# Altium schematic sheet Output.SchDoc: Output
size A3; Organization: Hofmann Travel; SheetNumber: 5; SheetTotal: 10
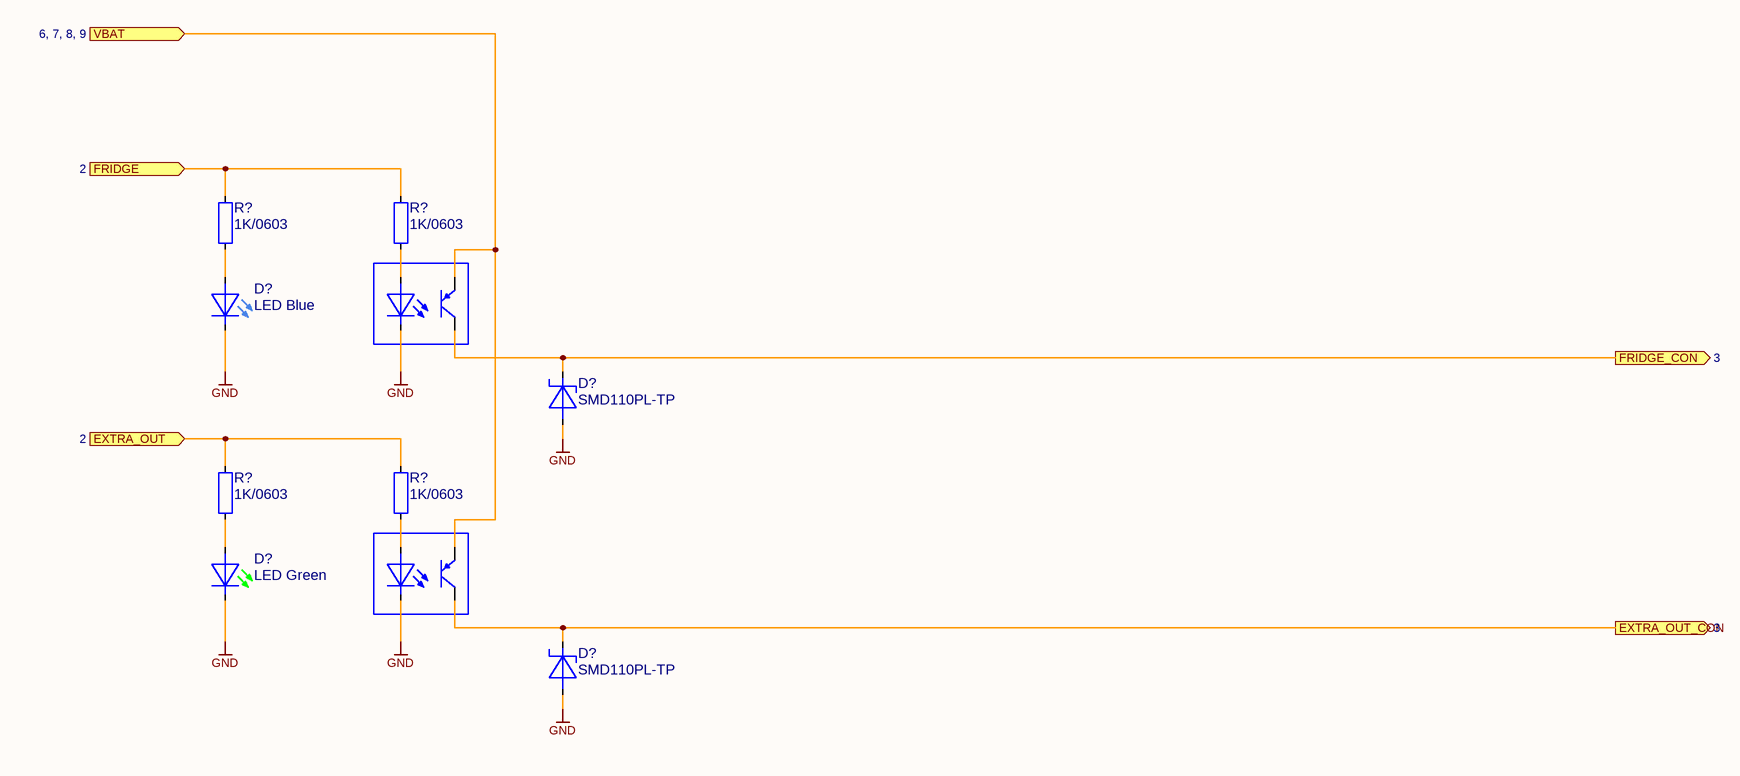
[diagram p0: Output.SchDoc]

## Parts
(Parts that share a designator on the sheet are numbered #1, #2 ... from top to bottom, then left to right.)
D?#1  LED Blue  [LED0603_BLUE]
D?#2  LED White  [LED0603_WHITE]  (value not drawn)
D?#3  SMD110PL-TP  [SOD3718X125]
D?#4  LED Green  [LED0603_GREEN]
D?#5  LED White  [LED0603_WHITE]  (value not drawn)
D?#6  SMD110PL-TP  [SOD3718X125]
Q?#1  MMBT4403L  [SOT2395P280X125-3-SE]  (value not drawn)
Q?#2  MMBT4403L  [SOT2395P280X125-3-SE]  (value not drawn)
R?#1  1K/0603  [R0603-0.40-WW]
R?#2  1K/0603  [R0603-0.40-WW]
R?#3  1K/0603  [R0603-0.40-WW]
R?#4  1K/0603  [R0603-0.40-WW]

## Ports
EXTRA_OUT (in, see 2), EXTRA_OUT_CON (out, see 3), FRIDGE (in, see 2), FRIDGE_CON (out, see 3), VBAT (in, see 6, 7, 8, 9)

## Nets
GND: D?#1.1 D?#2.1 D?#3.2 D?#4.1 D?#5.1 D?#6.2
EXTRA_OUT: R?#3.1 R?#4.1 ; port EXTRA_OUT
EXTRA_OUT_CON: D?#6.1 Q?#2.3(COLLECTOR) ; port EXTRA_OUT_CON
FRIDGE: R?#1.1 R?#2.1 ; port FRIDGE
FRIDGE_CON: D?#3.1 Q?#1.3(COLLECTOR) ; port FRIDGE_CON
VBAT: Q?#1.2(EMITTER) Q?#2.2(EMITTER) ; port VBAT
NetD?#1_2: D?#1.2 R?#1.2
NetD?#2_2: D?#2.2 R?#2.2
NetD?#4_2: D?#4.2 R?#3.2
NetD?#5_2: D?#5.2 R?#4.2

Not connected (* = marked no-connect by the designer): Q?#1 1(BASE); Q?#2 1(BASE)

## Notes on the sheet
- Date:
- Size:
- A3
- Schema:
- Layout:

## Library data of the parts
D?#1 = LED BLUE 0603: Generic LED Blue 0603; Manufacturer 1: Würth; Manufacturer Part Number 1: 150060BS75000; Part Number: LED Blue 0603; Manufacturer: GENERIC; Package: 603; Value: Blue; Absolute Value: Blue; HelpURL: https://www.we-online.com/katalog/datasheet/150060BS75000.pdf; Supplier 1: Digikey; Supplier Part Number 1: 732-4966-1-ND; Manufacturer 3: Everlight Elec; Manufacturer Part Number 3: 19-217/BHC-ZL1M2RY/3T; Supplier 3: LCSC; Supplier Part Number 3: C72041; JLC Type: Basic
D?#2 D?#5 = LED WHITE 0603: Generic LED White 0603; Manufacturer 1: Inolux; Manufacturer Part Number 1: IN-S63BT5UW; Part Number: LED White 0603; Manufacturer: GENERIC; Package: 603; Value: White; Absolute Value: White; HelpURL: https://www.inolux-corp.com/datasheet/SMDLED/Mono%20Color%20Top%20View/IN-S63BT%20Series_V1.0.pdf; Supplier 1: Digikey; Supplier Part Number 1: 1830-1070-1-ND; Manufacturer 3: Hubei KENTO Elec; Manufacturer Part Number 3: KT-0603W; Supplier 3: LCSC; Supplier Part Number 3: C2290; JLC Type: Basic
D?#3 D?#6 = SMD110PL-TP: Schottky 100 V 1A Oberflächenmontage SOD-123FL; Manufacturer: Micro Commercial Co; Absolute Value: 100V; Part Number: SMD110PL-TP; Package: SOD-123FL; Value: SMD110PL-TP; HelpURL: https://www.mccsemi.com/pdf/Products/SMD110PL-SMD1200PL(SOD-123FL).pdf; Manufacturer 1: Micro Commercial Co; Manufacturer Part Number 1: SMD110PL-TP; Supplier 1: Digikey; Supplier Part Number 1: SMD110PL-TPMSCT-ND
D?#4 = LED GREEN 0603: Generic LED Green 0603; Manufacturer 1: Würth; Manufacturer Part Number 1: 150060VS75000; Part Number: LED Green 0603; Manufacturer: GENERIC; Package: 603; Value: Green; Absolute Value: Green; HelpURL: https://www.we-online.com/katalog/datasheet/150060VS75000.pdf; Supplier 1: Digikey; Supplier Part Number 1: 732-4980-1-ND; Manufacturer 3: Everlight Elec; Manufacturer Part Number 3: 19-217/GHC-YR1S2/3T; Supplier 3: LCSC; Supplier Part Number 3: C72043; JLC Type: Basic
Q?#1 Q?#2 = MMBT4403L: Switching Transistor PNP Silicon; Manufacturer: ON SEMI; Part Number: MMBT4403L; Package: SOT23; HelpURL: https://www.onsemi.com/pdf/datasheet/mmbt4403lt1-d.pdf; Manufacturer 3: ONSEMI; Manufacturer Part Number 3: MMBT4403LT1G; Supplier 3: LCSC; Supplier Part Number 3: C78864; JLC Type: Extended
R?#1-R?#4 = 1K/0603: RES SM 0603 1K; Manufacturer: GENERIC; Manufacturer 1: YAGEO; Manufacturer Part Number 1: RC0603FR-131KL; Absolute Value: 1000; Eurocircuits GPN: GPR06031K; Part Number: 1K/0603; Package: 0603; Value: 1K; HelpURL: https://www.yageo.com/upload/media/product/app/datasheet/rchip/pyu-rc_group_51_rohs_l.pdf; Supplier 1: Digi-Key; Supplier Part Number 1: 13-RC0603FR-131KLCT-ND; Manufacturer 2: YAGEO; Manufacturer Part Number 2: RC0603FR-101KL; Supplier 2: Digi-Key; Supplier Part Number 2: 13-RC0603FR-101KLCT-ND; Manufacturer 3: UNI-ROYAL(Uniroyal Elec); Manufacturer Part Number 3: 0603WAF1001T5E; Supplier 3: LCSC; Supplier Part Number 3: C21190; JLC Type: Basic